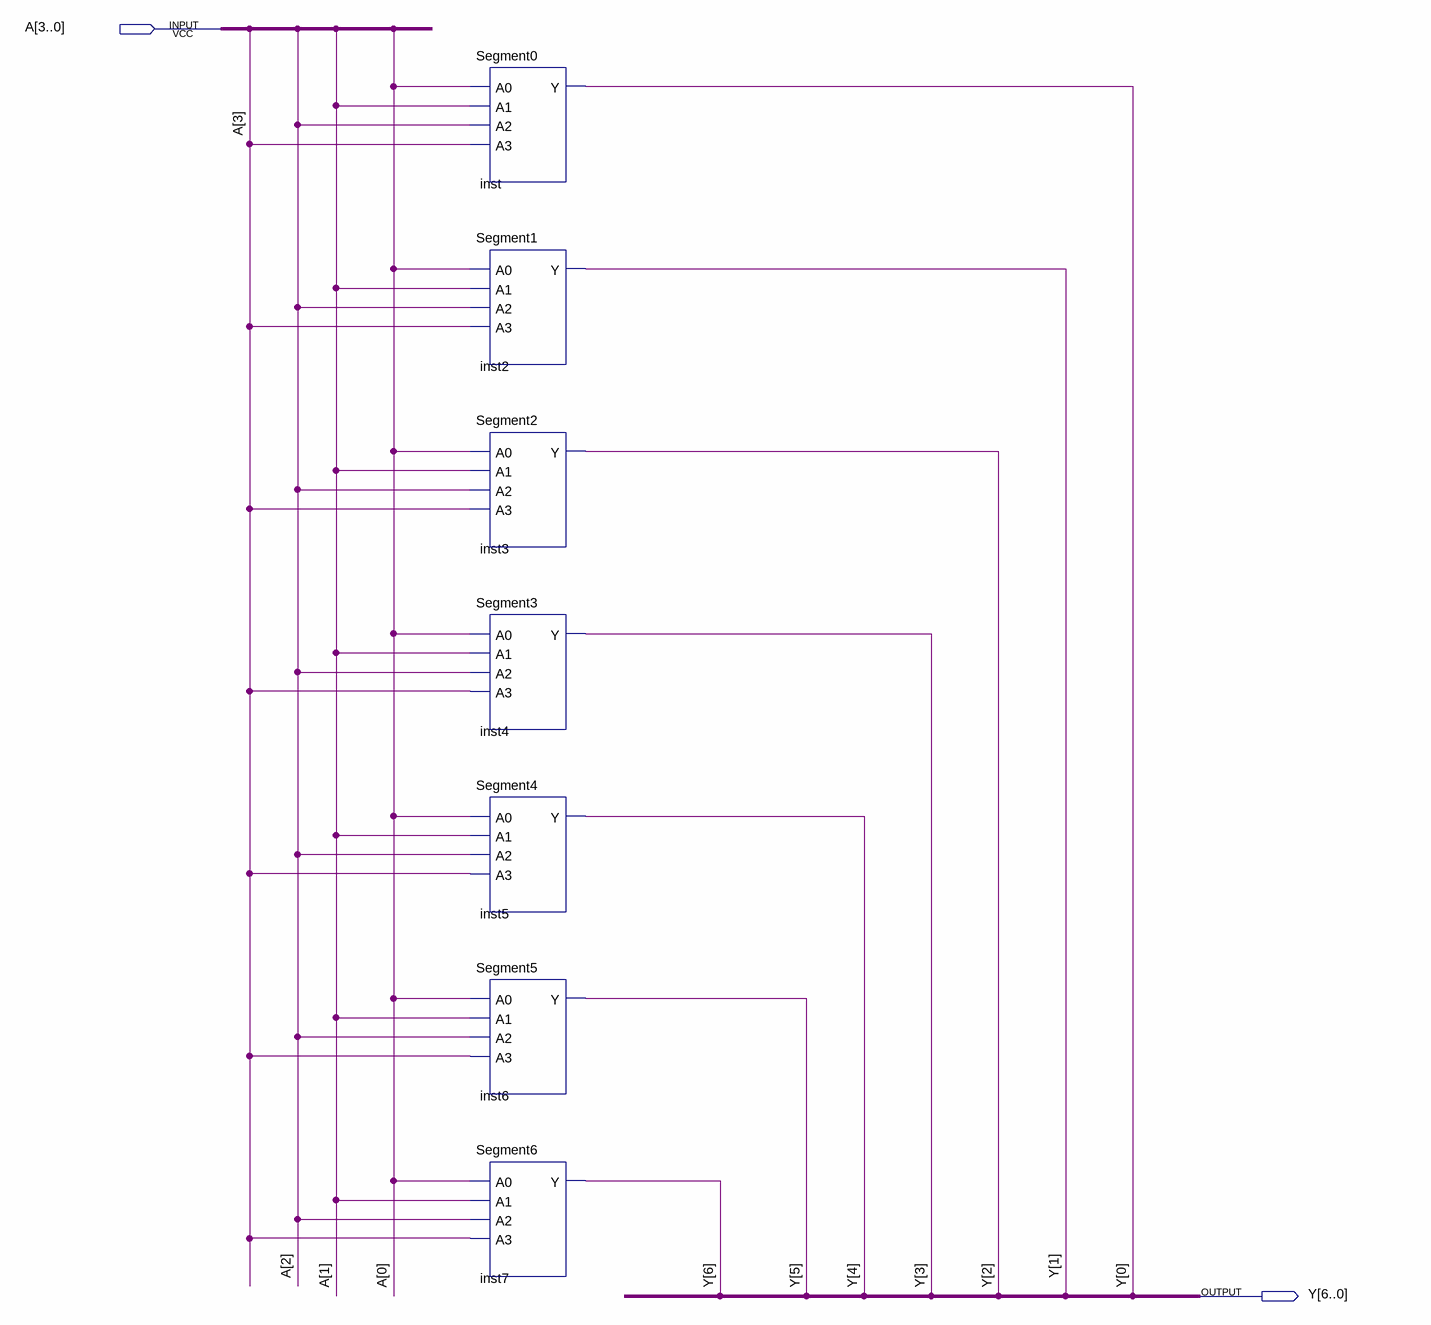
[diagram p0: schematic sheet]
// Quartus schematic FullSegmentDisplay.bdf as structural Verilog: 7 symbols, 2 pins
module FullSegmentDisplay (
  input  [3:0] A,
  output [6:0] Y
);

  Segment0 inst (.A0(A[0]), .A1(A[1]), .A2(A[2]), .A3(A[3]), .Y(Y[0]));
  Segment1 inst2 (.A0(A[0]), .A1(A[1]), .A2(A[2]), .A3(A[3]), .Y(Y[1]));
  Segment2 inst3 (.A0(A[0]), .A1(A[1]), .A2(A[2]), .A3(A[3]), .Y(Y[2]));
  Segment3 inst4 (.A0(A[0]), .A1(A[1]), .A2(A[2]), .A3(A[3]), .Y(Y[3]));
  Segment4 inst5 (.A0(A[0]), .A1(A[1]), .A2(A[2]), .A3(A[3]), .Y(Y[4]));
  Segment5 inst6 (.A0(A[0]), .A1(A[1]), .A2(A[2]), .A3(A[3]), .Y(Y[5]));
  Segment6 inst7 (.A0(A[0]), .A1(A[1]), .A2(A[2]), .A3(A[3]), .Y(Y[6]));
endmodule
